# Altium schematic sheet Top.SchDoc
size A
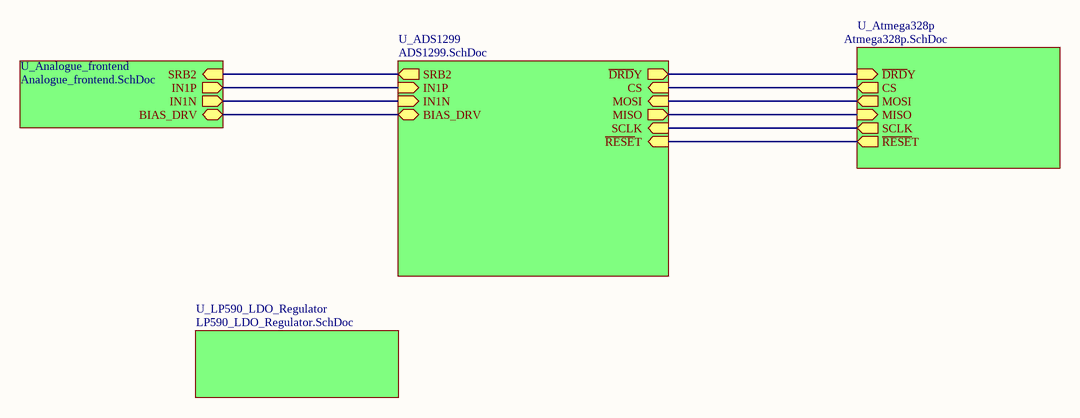
[diagram p0: Top.SchDoc]

## Sub-sheets
U_ADS1299 = ADS1299.SchDoc: MISO (out), CS (in), SCLK (in), MOSI (in), SRB2 (out), IN1P (in), IN1N (in), ~{DRD}Y (out), BIAS_DRV (bidir), ~{RESE}T (in)
U_Analogue_frontend = Analogue_frontend.SchDoc: BIAS_DRV (bidir), IN1N (out), IN1P (out), SRB2 (in)
U_Atmega328p = Atmega328p.SchDoc: CS (out), MOSI (out), MISO (in), SCLK (out), ~{DRD}Y (in), ~{RESE}T (out)
U_LP590_LDO_Regulator = LP590_LDO_Regulator.SchDoc: no entries

## Nets
(unnamed): sheet U_ADS1299/MISO, sheet U_Atmega328p/MISO
(unnamed): sheet U_ADS1299/CS, sheet U_Atmega328p/CS
(unnamed): sheet U_ADS1299/SCLK, sheet U_Atmega328p/SCLK
(unnamed): sheet U_ADS1299/MOSI, sheet U_Atmega328p/MOSI
(unnamed): sheet U_ADS1299/SRB2, sheet U_Analogue_frontend/SRB2
(unnamed): sheet U_ADS1299/IN1P, sheet U_Analogue_frontend/IN1P
(unnamed): sheet U_ADS1299/IN1N, sheet U_Analogue_frontend/IN1N
(unnamed): sheet U_ADS1299/~{DRD}Y, sheet U_Atmega328p/~{DRD}Y
(unnamed): sheet U_ADS1299/BIAS_DRV, sheet U_Analogue_frontend/BIAS_DRV
(unnamed): sheet U_ADS1299/~{RESE}T, sheet U_Atmega328p/~{RESE}T